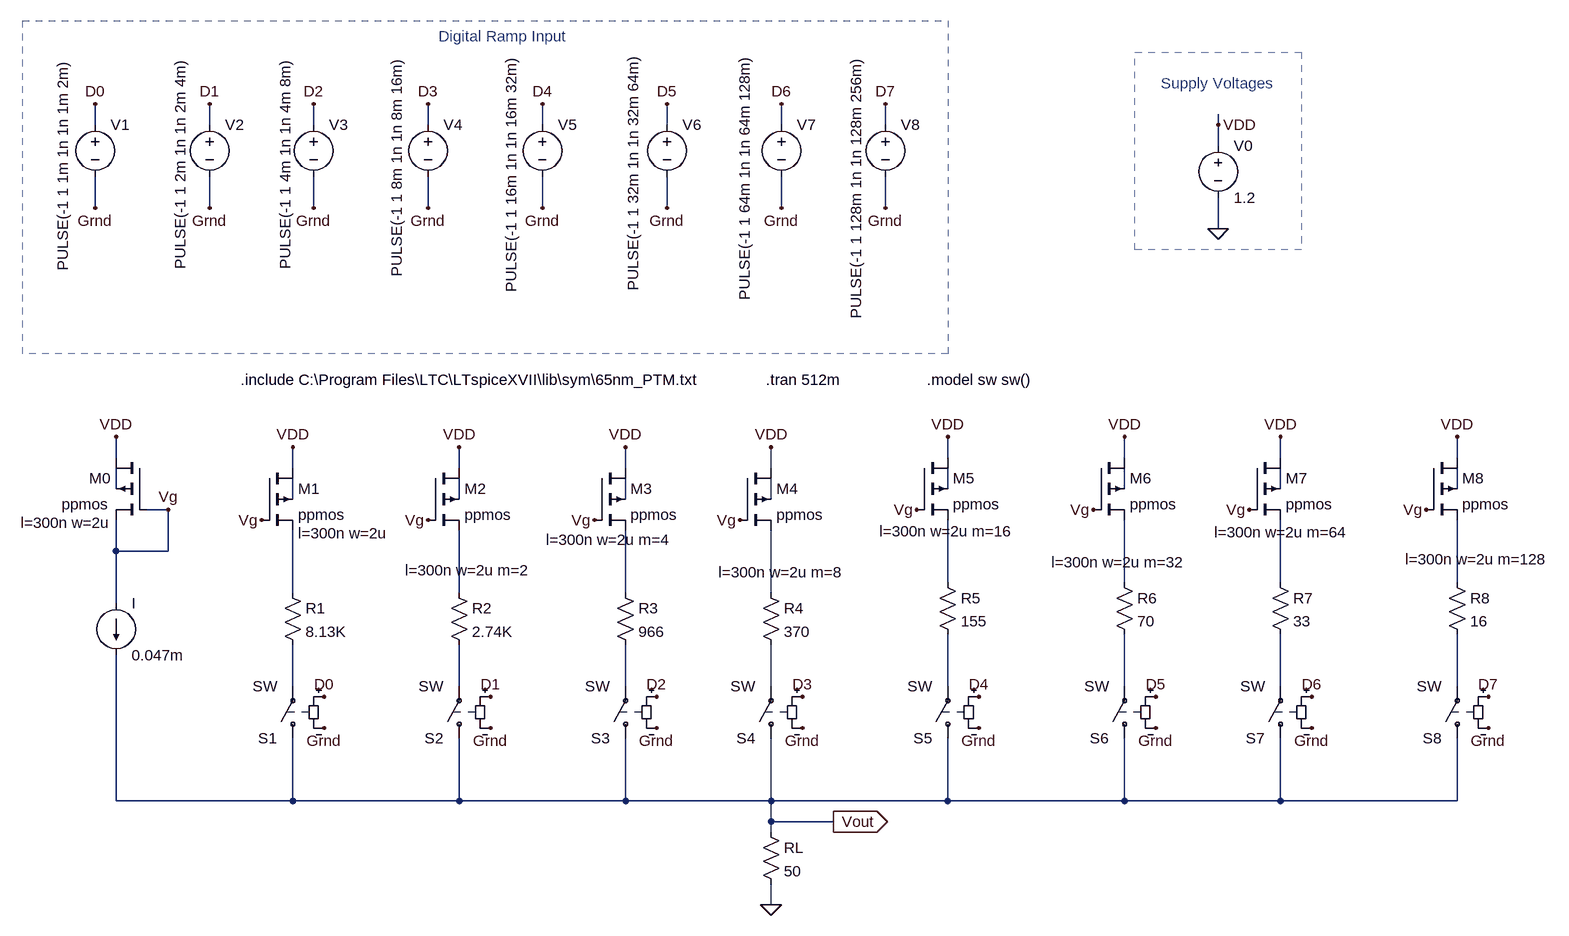
[diagram p0: schematic DAC_simple_current_mirror.asc]
DAC_simple_current_mirror.asc, the LTspice schematic file:
Version 4
SHEET 1 1792 1108
WIRE -512 -480 -512 -512
WIRE -336 -480 -336 -512
WIRE -176 -480 -176 -512
WIRE 0 -480 0 -512
WIRE 176 -480 176 -512
WIRE 368 -480 368 -512
WIRE 544 -480 544 -512
WIRE 704 -480 704 -512
WIRE 1216 -480 1216 -496
WIRE 1216 -448 1216 -480
WIRE -512 -352 -512 -400
WIRE -336 -352 -336 -400
WIRE -176 -352 -176 -400
WIRE 0 -352 0 -400
WIRE 176 -352 176 -400
WIRE 368 -352 368 -400
WIRE 544 -352 544 -400
WIRE 704 -352 704 -400
WIRE 1216 -320 1216 -368
WIRE -480 32 -480 0
WIRE 800 32 800 0
WIRE 1072 32 1072 0
WIRE 1312 32 1312 0
WIRE 1584 32 1584 0
WIRE -208 48 -208 16
WIRE 48 48 48 16
WIRE 304 48 304 16
WIRE 528 48 528 16
WIRE -480 80 -480 48
WIRE 800 80 800 48
WIRE 1072 80 1072 48
WIRE 1312 80 1312 48
WIRE 1584 80 1584 48
WIRE -208 96 -208 64
WIRE 48 96 48 64
WIRE 304 96 304 64
WIRE 528 96 528 64
WIRE -400 112 -432 112
WIRE -480 176 -480 128
WIRE -400 176 -400 112
WIRE -400 176 -480 176
WIRE 800 224 800 128
WIRE 1072 224 1072 128
WIRE 1312 224 1312 128
WIRE 1584 224 1584 128
WIRE -208 240 -208 144
WIRE 48 240 48 144
WIRE 304 240 304 144
WIRE 528 240 528 144
WIRE -480 256 -480 176
WIRE -208 384 -208 320
WIRE 48 384 48 320
WIRE 304 384 304 320
WIRE 528 384 528 320
WIRE 800 384 800 304
WIRE 1072 384 1072 304
WIRE 1312 384 1312 304
WIRE 1584 384 1584 304
WIRE -480 560 -480 336
WIRE -208 560 -208 464
WIRE -208 560 -480 560
WIRE 48 560 48 464
WIRE 48 560 -208 560
WIRE 304 560 304 464
WIRE 304 560 48 560
WIRE 528 560 528 464
WIRE 528 560 304 560
WIRE 800 560 800 464
WIRE 800 560 528 560
WIRE 1072 560 1072 464
WIRE 1072 560 800 560
WIRE 1312 560 1312 464
WIRE 1312 560 1072 560
WIRE 1584 560 1584 464
WIRE 1584 560 1312 560
WIRE 528 592 528 560
WIRE 624 592 528 592
WIRE 528 608 528 592
WIRE 528 720 528 688
FLAG 528 720 0
FLAG 1216 -480 VDD
FLAG -480 0 VDD
FLAG -208 16 VDD
FLAG 48 16 VDD
FLAG 304 16 VDD
FLAG 528 16 VDD
FLAG 800 0 VDD
FLAG 1072 0 VDD
FLAG 1312 0 VDD
FLAG 1584 0 VDD
FLAG -400 112 Vg
FLAG -256 128 Vg
FLAG 0 128 Vg
FLAG 256 128 Vg
FLAG 480 128 Vg
FLAG 752 112 Vg
FLAG 1024 112 Vg
FLAG 1264 112 Vg
FLAG 1536 112 Vg
FLAG -160 448 Grnd
FLAG 96 448 Grnd
FLAG 352 448 Grnd
FLAG 576 448 Grnd
FLAG 848 448 Grnd
FLAG 1120 448 Grnd
FLAG 1360 448 Grnd
FLAG 1632 448 Grnd
FLAG -160 400 D0
FLAG 96 400 D1
FLAG 352 400 D2
FLAG 576 400 D3
FLAG 848 400 D4
FLAG 1120 400 D5
FLAG 1360 400 D6
FLAG 1632 400 D7
FLAG -336 -352 Grnd
FLAG -176 -352 Grnd
FLAG 0 -352 Grnd
FLAG 176 -352 Grnd
FLAG 368 -352 Grnd
FLAG 544 -352 Grnd
FLAG 704 -352 Grnd
FLAG -512 -352 Grnd
FLAG -512 -512 D0
FLAG -336 -512 D1
FLAG -176 -512 D2
FLAG 0 -512 D3
FLAG 176 -512 D4
FLAG 368 -512 D5
FLAG 544 -512 D6
FLAG 704 -512 D7
FLAG 624 592 Vout
IOPIN 624 592 Out
FLAG 1216 -320 0
SYMBOL pmos4 -432 32 M0
WINDOW 3 59 72 Left 2
WINDOW 123 56 100 Left 2
SYMATTR Value ppmos
SYMATTR Value2 l=300n w=2u
SYMATTR InstName M0
SYMBOL pmos4 0 48 R0
WINDOW 123 -35 157 Left 2
SYMATTR Value2 l=300n w=2u m=2
SYMATTR InstName M2
SYMATTR Value ppmos
SYMBOL pmos4 256 48 R0
WINDOW 123 -74 110 Left 2
SYMATTR Value2 l=300n w=2u m=4
SYMATTR InstName M3
SYMATTR Value ppmos
SYMBOL pmos4 480 48 R0
WINDOW 123 -33 160 Left 2
SYMATTR Value2 l=300n w=2u m=8
SYMATTR InstName M4
SYMATTR Value ppmos
SYMBOL pmos4 752 32 R0
WINDOW 123 -57 113 Left 2
SYMATTR Value2 l=300n w=2u m=16
SYMATTR InstName M5
SYMATTR Value ppmos
SYMBOL pmos4 1024 32 R0
WINDOW 123 -65 161 Left 2
SYMATTR Value2 l=300n w=2u m=32
SYMATTR InstName M6
SYMATTR Value ppmos
SYMBOL pmos4 1264 32 R0
WINDOW 123 -54 115 Left 2
SYMATTR Value2 l=300n w=2u m=64
SYMATTR InstName M7
SYMATTR Value ppmos
SYMBOL pmos4 1536 32 R0
WINDOW 123 -32 156 Left 2
SYMATTR Value2 l=300n w=2u m=128
SYMATTR InstName M8
SYMATTR Value ppmos
SYMBOL res 512 592 R0
SYMATTR InstName RL
SYMATTR Value 50
SYMBOL voltage 1216 -464 R0
WINDOW 123 0 0 Left 0
WINDOW 39 0 0 Left 0
SYMATTR InstName V0
SYMATTR Value 1.2
SYMBOL current -480 256 R0
WINDOW 123 0 0 Left 0
WINDOW 39 0 0 Left 0
SYMATTR InstName I
SYMATTR Value 0.047m
SYMBOL res 32 224 R0
SYMATTR InstName R2
SYMATTR Value 2.74K
SYMBOL res -224 224 R0
SYMATTR InstName R1
SYMATTR Value 8.13K
SYMBOL res 288 224 R0
SYMATTR InstName R3
SYMATTR Value 966
SYMBOL res 512 224 R0
SYMATTR InstName R4
SYMATTR Value 370
SYMBOL res 784 208 R0
SYMATTR InstName R5
SYMATTR Value 155
SYMBOL res 1056 208 R0
SYMATTR InstName R6
SYMATTR Value 70
SYMBOL res 1296 208 R0
SYMATTR InstName R7
SYMATTR Value 33
SYMBOL res 1568 208 R0
SYMATTR InstName R8
SYMATTR Value 16
SYMBOL sw -208 480 R180
SYMATTR InstName S1
SYMBOL sw 48 480 R180
SYMATTR InstName S2
SYMBOL sw 528 480 R180
SYMATTR InstName S4
SYMBOL sw 800 480 R180
SYMATTR InstName S5
SYMBOL sw 1072 480 R180
SYMATTR InstName S6
SYMBOL sw 1312 480 R180
SYMATTR InstName S7
SYMBOL sw 1584 480 R180
SYMATTR InstName S8
SYMBOL sw 304 480 R180
SYMATTR InstName S3
SYMBOL voltage -512 -496 R0
WINDOW 3 -50 -85 VRight 2
WINDOW 123 0 0 Left 0
WINDOW 39 0 0 Left 0
SYMATTR Value PULSE(-1 1 1m 1n 1n 1m 2m)
SYMATTR InstName V1
SYMBOL voltage -336 -496 R0
WINDOW 3 -45 -87 VRight 2
WINDOW 123 0 0 Left 0
WINDOW 39 0 0 Left 0
SYMATTR Value PULSE(-1 1 2m 1n 1n 2m 4m)
SYMATTR InstName V2
SYMBOL voltage -176 -496 R0
WINDOW 3 -44 -87 VRight 2
WINDOW 123 0 0 Left 0
WINDOW 39 0 0 Left 0
SYMATTR Value PULSE(-1 1 4m 1n 1n 4m 8m)
SYMATTR InstName V3
SYMBOL voltage 0 -496 R0
WINDOW 3 -48 -89 VRight 2
WINDOW 123 0 0 Left 0
WINDOW 39 0 0 Left 0
SYMATTR Value PULSE(-1 1 8m 1n 1n 8m 16m)
SYMATTR InstName V4
SYMBOL voltage 176 -496 R0
WINDOW 3 -48 -92 VRight 2
WINDOW 123 0 0 Left 0
WINDOW 39 0 0 Left 0
SYMATTR Value PULSE(-1 1 16m 1n 1n 16m 32m)
SYMATTR InstName V5
SYMBOL voltage 368 -496 R0
WINDOW 3 -52 -94 VRight 2
WINDOW 123 0 0 Left 0
WINDOW 39 0 0 Left 0
SYMATTR Value PULSE(-1 1 32m 1n 1n 32m 64m)
SYMATTR InstName V6
SYMBOL voltage 544 -496 R0
WINDOW 3 -57 -93 VRight 2
WINDOW 123 0 0 Left 0
WINDOW 39 0 0 Left 0
SYMATTR Value PULSE(-1 1 64m 1n 1n 64m 128m)
SYMATTR InstName V7
SYMBOL voltage 704 -496 R0
WINDOW 3 -45 -92 VRight 2
WINDOW 123 0 0 Left 0
WINDOW 39 0 0 Left 0
SYMATTR Value PULSE(-1 1 128m 1n 1n 128m 256m)
SYMATTR InstName V8
SYMBOL pmos4 -256 48 R0
WINDOW 123 56 100 Left 2
SYMATTR Value2 l=300n w=2u
SYMATTR InstName M1
SYMATTR Value ppmos
TEXT -288 -88 Left 2 !.include C:\\Program Files\\LTC\\LTspiceXVII\\lib\\sym\\65nm_PTM.txt
TEXT 520 -88 Left 2 !.tran 512m
TEXT 768 -88 Left 2 !.model sw sw()
TEXT 1128 -544 Left 2 ;Supply Voltages
TEXT 16 -616 Left 2 ;Digital Ramp Input
RECTANGLE Normal 800 -128 -624 -640 2
RECTANGLE Normal 1344 -288 1088 -592 2

The netlist it stands for:
* DAC_simple_current_mirror.asc
M0 VDD Vg Vg N001 ppmos l=300n w=2u
M2 VDD Vg N015 N007 ppmos l=300n w=2u m=2
M3 VDD Vg N016 N008 ppmos l=300n w=2u m=4
M4 VDD Vg N017 N009 ppmos l=300n w=2u m=8
M5 VDD Vg N010 N002 ppmos l=300n w=2u m=16
M6 VDD Vg N011 N003 ppmos l=300n w=2u m=32
M7 VDD Vg N012 N004 ppmos l=300n w=2u m=64
M8 VDD Vg N013 N005 ppmos l=300n w=2u m=128
RL Vout 0 50
V0 VDD 0 1.2
I Vg Vout 0.047m
R2 N015 N019 2.74K
R1 N014 N018 8.13K
R3 N016 N020 966
R4 N017 N021 370
R5 N010 N022 155
R6 N011 N023 70
R7 N012 N024 33
R8 N013 N025 16
S1 Vout N018 D0 Grnd SW
S2 Vout N019 D1 Grnd SW
S4 Vout N021 D3 Grnd SW
S5 Vout N022 D4 Grnd SW
S6 Vout N023 D5 Grnd SW
S7 Vout N024 D6 Grnd SW
S8 Vout N025 D7 Grnd SW
S3 Vout N020 D2 Grnd SW
V1 D0 Grnd PULSE(-1 1 1m 1n 1n 1m 2m)
V2 D1 Grnd PULSE(-1 1 2m 1n 1n 2m 4m)
V3 D2 Grnd PULSE(-1 1 4m 1n 1n 4m 8m)
V4 D3 Grnd PULSE(-1 1 8m 1n 1n 8m 16m)
V5 D4 Grnd PULSE(-1 1 16m 1n 1n 16m 32m)
V6 D5 Grnd PULSE(-1 1 32m 1n 1n 32m 64m)
V7 D6 Grnd PULSE(-1 1 64m 1n 1n 64m 128m)
V8 D7 Grnd PULSE(-1 1 128m 1n 1n 128m 256m)
M1 VDD Vg N014 N006 ppmos l=300n w=2u
.model NMOS NMOS
.model PMOS PMOS
.lib standard.mos
.include C:\Program Files\LTC\LTspiceXVII\lib\sym\65nm_PTM.txt
.tran 512m
.model sw sw()
* Supply Voltages
* Digital Ramp Input
.backanno
.end